# Altium schematic sheet buck.SchDoc
size A3
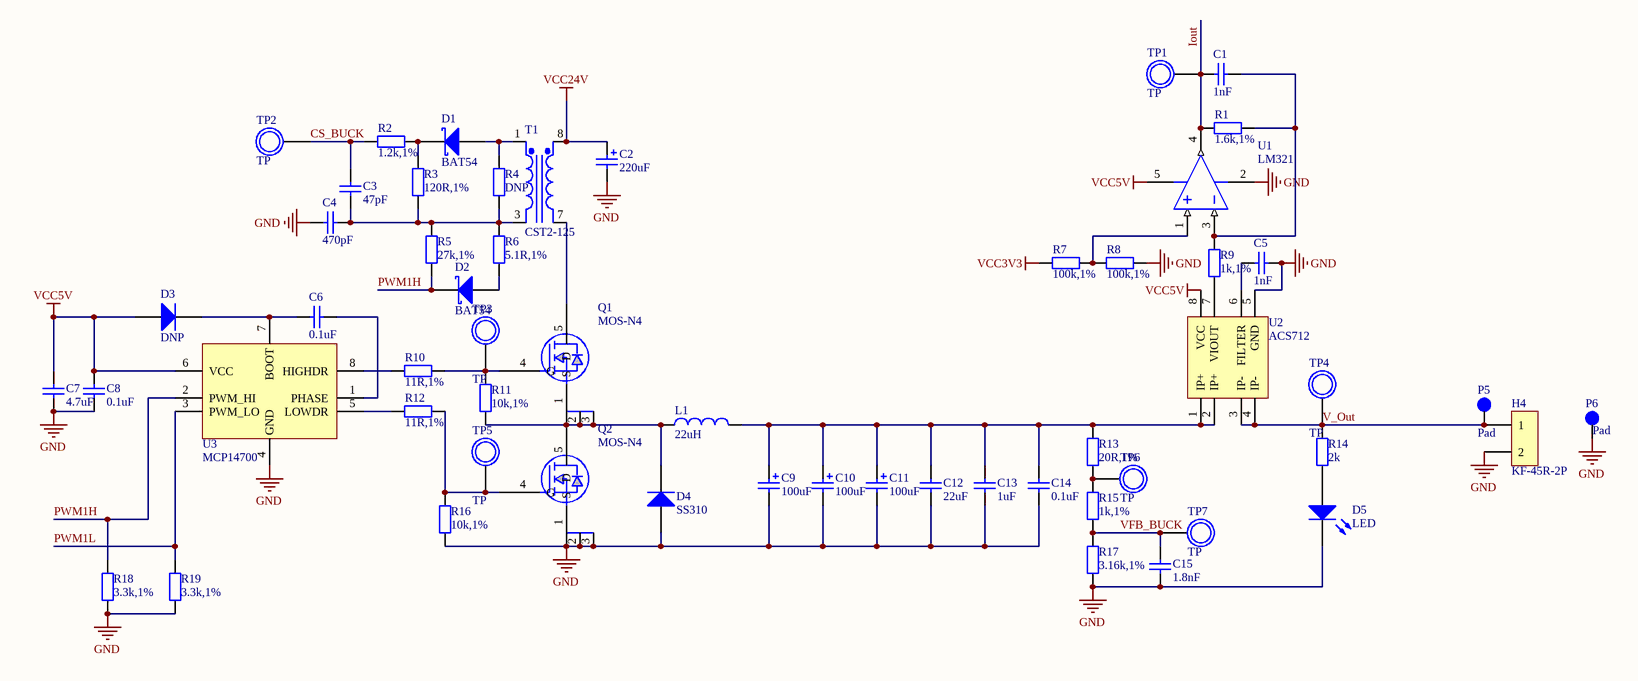
[diagram p0: buck.SchDoc]

## Parts
C1  1nF  [CAP0603]
C2  220uF  [CAPAE109103X105N]
C3  47pF  [CAP0603]
C4  470pF  [CAP0603]
C5  1nF  [CAP0603]
C6  0.1uF  [CAP0603]
C7  4.7uF  [CAP0603]
C8  0.1uF  [CAP0603]
C9  100uF  [CAPAE8983X105N]
C10  100uF  [CAPAE8983X105N]
C11  100uF  [CAPAE8983X105N]
C12  22uF  [CAP1206]
C13  1uF  [CAP1206]
C14  0.1uF  [CAP1206]
C15  1.8nF  [CAP0603]
D1  BAT54  [SOD250X100-2N]
D2  BAT54  [SOD250X100-2N]
D3  DNP  [SMA]
D4  SS310  [SMA]
D5  LED  [LED0402]
H4  KF-45R-2P  [KF-45R-2P]
L1  22uH  [CDRH125]
P5  Pad  [PAD10x50]
P6  Pad  [PAD10x50]
Q1  MOS-N4  [QFN5x6]
Q2  MOS-N4  [QFN5x6]
R1  1.6k,1%  [RES0603]
R2  1.2k,1%  [RES0603]
R3  120R,1%  [RES0603]
R4  DNP  [RES0603]
R5  27k,1%  [RES0603]
R6  5.1R,1%  [RES0603]
R7  100k,1%  [RES0603]
R8  100k,1%  [RES0603]
R9  1k,1%  [RES0603]
R10  11R,1%  [RES0603]
R11  10k,1%  [RES0603]
R12  11R,1%  [RES0603]
R13  20R,1%  [RES0603]
R14  2k  [RES0402]
R15  1k,1%  [RES0603]
R16  10k,1%  [RES0603]
R17  3.16k,1%  [RES0603]
R18  3.3k,1%  [RES0603]
R19  3.3k,1%  [RES0603]
T1  CST2-125  [CST2-125]
TP1  TP  [PAD85R]
TP2  TP  [PAD85R]
TP3  TP  [PAD85R]
TP4  TP  [PAD85R]
TP5  TP  [PAD85R]
TP6  TP  [PAD85R]
TP7  TP  [PAD85R]
U1  LM321  [SOT65P210X110-5N]
U2  ACS712  [SOP127P600X175-8N]
U3  MCP14700  [SOP127P600X175-8N]

## Nets
GND: C2.1 C4.2 C5.1 C7.1 C8.1 C9.1 C10.1 C11.1 C12.1 C13.1 C14.1 C15.1 D4.1(A) D5.2(K) H4.2 P6.1 Q2.1(S) Q2.2 Q2.3 R8.1 R16.2 R17.2 R18.1 R19.1 U1.2(V-) U2.5(GND) U3.4(GND)
VCC3V3: R7.2
VCC5V: C7.2 C8.2 D3.1(A) U1.5(V+) U2.8(VCC) U3.6(VCC)
VCC24V: C2.2 T1.8(Pri+)
CS_BUCK: C3.2 R2.2 TP2.1
Iout: C1.2 R1.1 TP1.1 U1.4(OUT)
PWM1H: D2.1(K) R5.2 R18.2 U3.2(PWM_HI)
PWM1L: R19.2 U3.3(PWM_LO)
V_Out: H4.1 P5.1 R14.2 TP4.1 U2.3(IP-) U2.4(IP-)
VFB_BUCK: C15.2 R15.2 R17.1 TP7.1
NetC1_1: C1.1 R1.2 R9.1 U1.3(IN-)
NetC3_1: C3.1 C4.1 R3.2 R4.1 R5.1 R6.1 T1.3(Sec-)
NetC5_2: C5.2 U2.6(FILTER)
NetC6_1: C6.1 U3.1(PHASE)
NetC6_2: C6.2 D3.2(K) U3.7(BOOT)
NetC9_2: C9.2 C10.2 C11.2 C12.2 C13.2 C14.2 L1.2 R13.1 U2.1(IP+) U2.2(IP+)
NetD1_1: D1.1(K) R2.1 R3.1
NetD1_2: D1.2(A) R4.2 T1.1(Sec+)
NetD2_2: D2.2(A) R6.2
NetD4_2: D4.2(K) L1.1 Q1.1(S) Q1.2 Q1.3 Q2.5(D) R11.2
NetD5_1: D5.1(A) R14.1
NetQ1_4: Q1.4(G) R10.1 R11.1 TP3.1
NetQ1_5: Q1.5(D) T1.7(Pri-)
NetQ2_4: Q2.4(G) R12.1 R16.1 TP5.1
NetR7_1: R7.1 R8.2 U1.1(IN+)
NetR9_2: R9.2 U2.7(VIOUT)
NetR10_2: R10.2 U3.8(HIGHDR)
NetR12_2: R12.2 U3.5(LOWDR)
NetR13_2: R13.2 R15.1 TP6.1

## Library data of the parts
C1 C3-C5 C7 C12 C13 C15 = CAP: CAP NON-POL; Tolerance: +/-10%; Rated Voltage: 50V; Capacitance Value: 0.1uF
C2 C9-C11 = CAP_Pol: cap pol; Tolerance: +\- 10%; Capacitance Value: 47uF; Rated Voltage: 50V
C6 C8 C14 = CAP: CAP NON-POL; Tolerance: +/-10%; Rated Voltage: 50V; Capacitance Value: 0.1uF
D1 D2 = Diode Schottky: Schottky Diode
D3 D4 = Diode
L1 = Inductor
Q1 Q2 = MOS-N4: N Channel MOSFET
R1-R19 = RES
T1 = CST2-125: Current Transformer 1:125
TP1-TP7 = Test_Point: test point
U1 = LM321: Low Power Single Op Amp
U2 = ACS712: Fully Integrated, Hall Effect-Based Linear Current Sensor with 2.1 kVRMS Voltage Isolation and a Low-Resistance Current Conductor
U3 = MCP14700: Dual Input Synchronous MOSFET Driver